# EAGLE design nsq-10 (EAGLE 6.2)
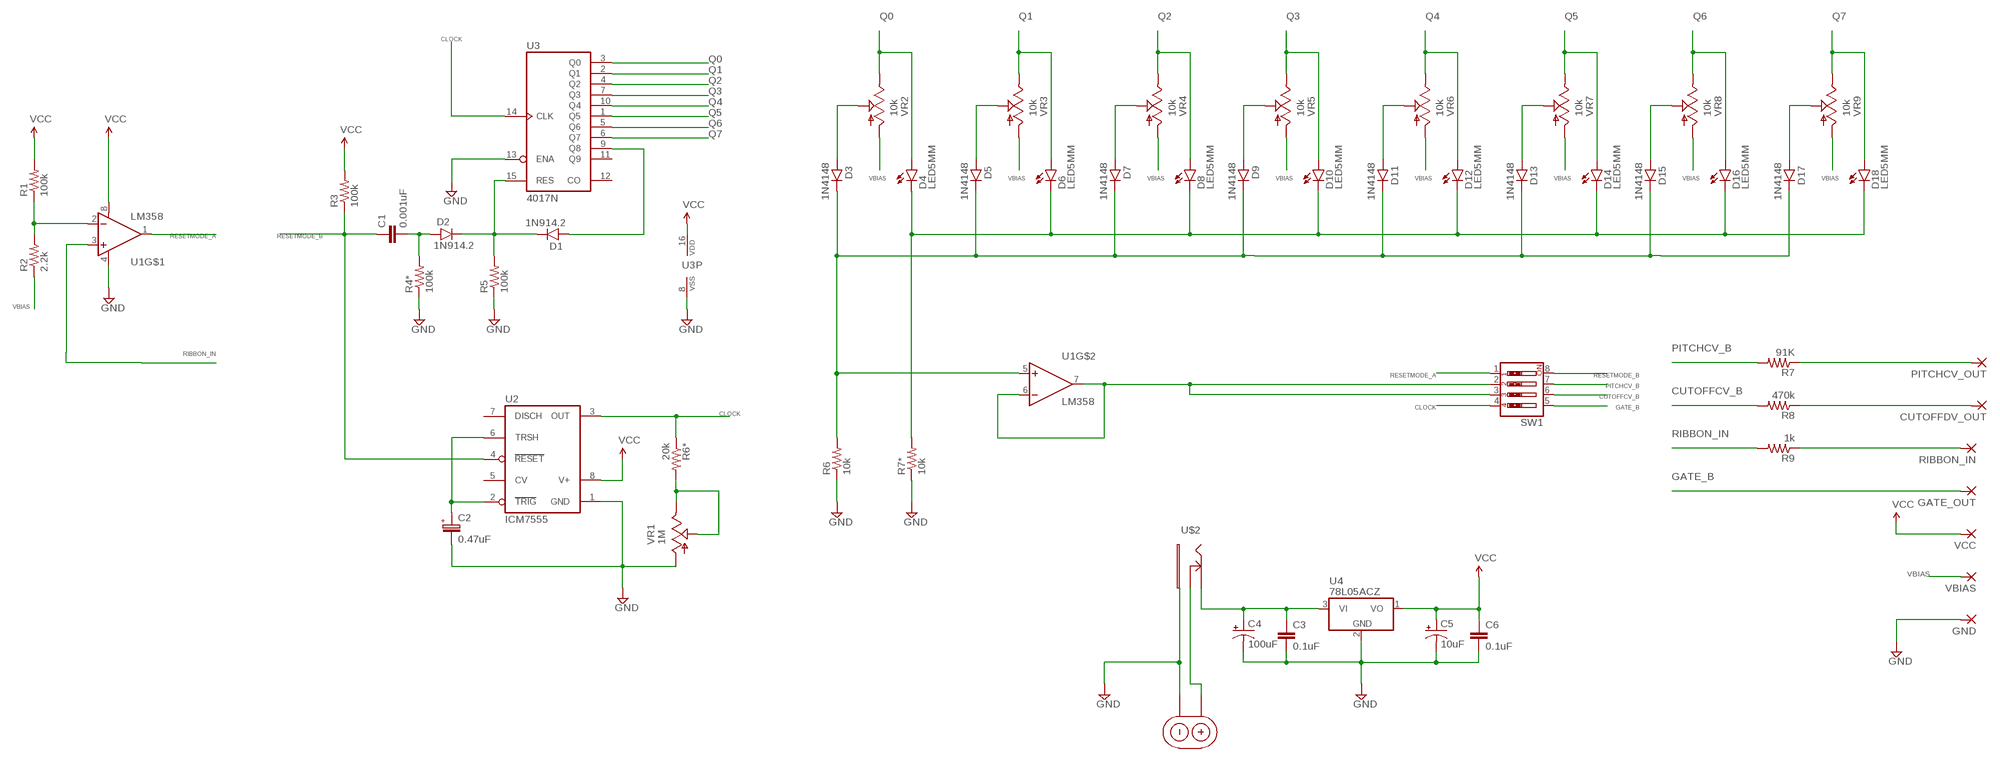
[diagram p0: schematic, sheet 1]

## Parts
C1  0.001uF  CERAMIC_CAPACITOR  [CERAMIC_CAP]
C2  0.47uF  063-EU  [063_025]
C3  0.1uF  CERAMIC_CAPACITOR  [CERAMIC_CAP]
C4  100uF  0631  [063_025]
C5  10uF  0631  [063_025]
C6  0.1uF  CERAMIC_CAPACITOR  [CERAMIC_CAP]
CUTOFFDV_OUT  1,6/0,8  [1,6/0,8]
D1  1N914.2  [DO35-2]
D2  1N914.2  [DO35-2]
D3  1N4148  1N914.2  [DO35-2]
D4  LED5MM  [LED5MM]
D5  1N4148  1N914.2  [DO35-2]
D6  LED5MM  [LED5MM]
D7  1N4148  1N914.2  [DO35-2]
D8  LED5MM  [LED5MM]
D9  1N4148  1N914.2  [DO35-2]
D10  LED5MM  [LED5MM]
D11  1N4148  1N914.2  [DO35-2]
D12  LED5MM  [LED5MM]
D13  1N4148  1N914.2  [DO35-2]
D14  LED5MM  [LED5MM]
D15  1N4148  1N914.2  [DO35-2]
D16  LED5MM  [LED5MM]
D17  1N4148  1N914.2  [DO35-2]
D18  LED5MM  [LED5MM]
GATE_OUT  1,6/0,8  [1,6/0,8]
GND  1,6/0,8  [1,6/0,8]
PITCHCV_OUT  1,6/0,8  [1,6/0,8]
R1  100k  RESISTOR  [RESISTOR]
R2  2.2k  RESISTOR  [RESISTOR]
R3  100k  RESISTOR  [RESISTOR]
R4*  100k  RESISTOR  [RESISTOR]
R5  100k  RESISTOR  [RESISTOR]
R6  10k  RESISTOR  [RESISTOR]
R6*  20k  RESISTOR  [RESISTOR]
R7  91K  RESISTOR  [RESISTOR]
R7*  10k  RESISTOR  [RESISTOR]
R8  470k  RESISTOR  [RESISTOR]
R9  1k  RESISTOR  [RESISTOR]
RIBBON_IN  1,6/0,8  [1,6/0,8]
SW1  SW_DIP-4  [EDG-04]
U1  LM358  [DIP08]
U2  ICM7555  [DIL08]
U3  4017N  [DIL16]
U4  78L05ACZ  [TO-92]
U$1  9V_BATTERY_CLIP  [9V_BATTERY]
U$2  DC_JACK_OFFBOARD  [DC_JACK_OFFBOARD]
VBIAS  1,6/0,8  [1,6/0,8]
VCC  1,6/0,8  [1,6/0,8]
VR1  1M  TRIM_US-B25P  [B25P]
VR2  10k  TRIM_US-B25P  [B25P]
VR3  10k  TRIM_US-B25P  [B25P]
VR4  10k  TRIM_US-B25P  [B25P]
VR5  10k  TRIM_US-B25P  [B25P]
VR6  10k  TRIM_US-B25P  [B25P]
VR7  10k  TRIM_US-B25P  [B25P]
VR8  10k  TRIM_US-B25P  [B25P]
VR9  10k  TRIM_US-B25P  [B25P]

## Nets
CLOCK: R6*.1 SW1.4 U2.3(OUT) U3.14(CLK)
CUTOFFCV_B: R8.2 SW1.6
GATE_B: GATE_OUT.1(P) SW1.5
GND: C2.- C3.2 C4.- C5.- C6.2 GND.1(P) R4*.1 R5.1 R6.1 R7*.1 U1.4(V-) U2.1(GND) U3.8(VSS) U3.13(ENA) U4.2(GND) U$1.9V_BATTERY_- U$2.PIN VR1.A
N$1: C1.2 D2.A R4*.2
N$2: R1.1 R2.2 U1.2(-IN)
N$3: R6*.2 VR1.E VR1.S
N$4: C2.+ U2.2(TRIG) U2.6(TRSH)
N$5: SW1.2 SW1.3 U1.6(-IN) U1.7(OUT)
N$6: D3.A VR2.S
N$7: R9.1 RIBBON_IN.1(P)
N$8: D5.A VR3.S
N$9: D1.A U3.9(Q8)
N$10: D1.C D2.C R5.2 U3.15(RES)
N$11: CUTOFFDV_OUT.1(P) R8.1
N$12: D7.A VR4.S
N$13: PITCHCV_OUT.1(P) R7.1
N$14: D9.A VR5.S
N$16: D11.A VR6.S
N$18: D13.A VR7.S
N$19: U$1.9V_BATTERY_+ U$2.CONNECT
N$20: D15.A VR8.S
N$21: C3.1 C4.+ U4.3(VI) U$2.SLEEVE
N$22: D17.A VR9.S
N$23: D4.K(C) D6.K(C) D8.K(C) D10.K(C) D12.K(C) D14.K(C) D16.K(C) D18.K(C) R7*.2
N$26: D3.C D5.C D7.C D9.C D11.C D13.C D15.C D17.C R6.2 U1.5(+IN)
PITCHCV_B: R7.2 SW1.7
Q0: D4.A U3.3(Q0) VR2.E
Q1: D6.A U3.2(Q1) VR3.E
Q2: D8.A U3.4(Q2) VR4.E
Q3: D10.A U3.7(Q3) VR5.E
Q4: D12.A U3.10(Q4) VR6.E
Q5: D14.A U3.1(Q5) VR7.E
Q6: D16.A U3.5(Q6) VR8.E
Q7: D18.A U3.6(Q7) VR9.E
RESETMODE_A: SW1.1 U1.1(OUT)
RESETMODE_B: C1.1 R3.1 SW1.8 U2.4(RESET)
RIBBON_IN: R9.2 U1.3(+IN)
VBIAS: R2.1 VBIAS.1(P) VR2.A VR3.A VR4.A VR5.A VR6.A VR7.A VR8.A VR9.A
VCC: C5.+ C6.1 R1.2 R3.2 U1.8(V+) U2.8(V+) U3.16(VDD) U4.1(VO) VCC.1(P)
Unconnected: U2.5(CV) U2.7(DISCH) U3.11(Q9) U3.12(CO)

## Library data of the parts
C1 C3 C6 = 00_steve:CERAMIC_CAPACITOR
C2 = gm-caps-electro-pol:063-EU
C4 C5 = gm-caps-electro-pol:063: 33 - 220uF Xicon values at Mouser.com 10V: 220uF; 16V: 100uF; 25V: 100uF; 50V: 33uF
CUTOFFDV_OUT GATE_OUT GND PITCHCV_OUT RIBBON_IN VBIAS VCC = wirepad:1,6/0,8: THROUGH-HOLE PAD
D1-D3 D5 D7 D9 D11 D13 D15 D17 = gm-diodes:1N914: Fast Switching Diode DO-35 glass case a.k.a. 1N4148
D4 D6 D8 D10 D12 D14 D16 D18 = gm-diodes:LED
R1-R3 R4* R5 R6 R6* R7 R7* R8 R9 = 00_steve:RESISTOR
SW1 = special:SW_DIP-4: DIP SWITCH
U1 = SparkFun:LM358
U2 = maxim:ICM7555: TIMER; MF: MAXIM; MPN: ICM7555IPA+; OC_FARNELL: 9663762; OC_NEWARK: 68K4387
U3 = 40xx:4017: COUNTER/DIVIDER
U4 = 00_steve:78L05ACZ
U$1 = 00_steve:9V_BATTERY_CLIP
U$2 = 00_steve:DC_JACK_OFFBOARD
VR1-VR9 = pot:TRIM_US-: POTENTIOMETER

## Board
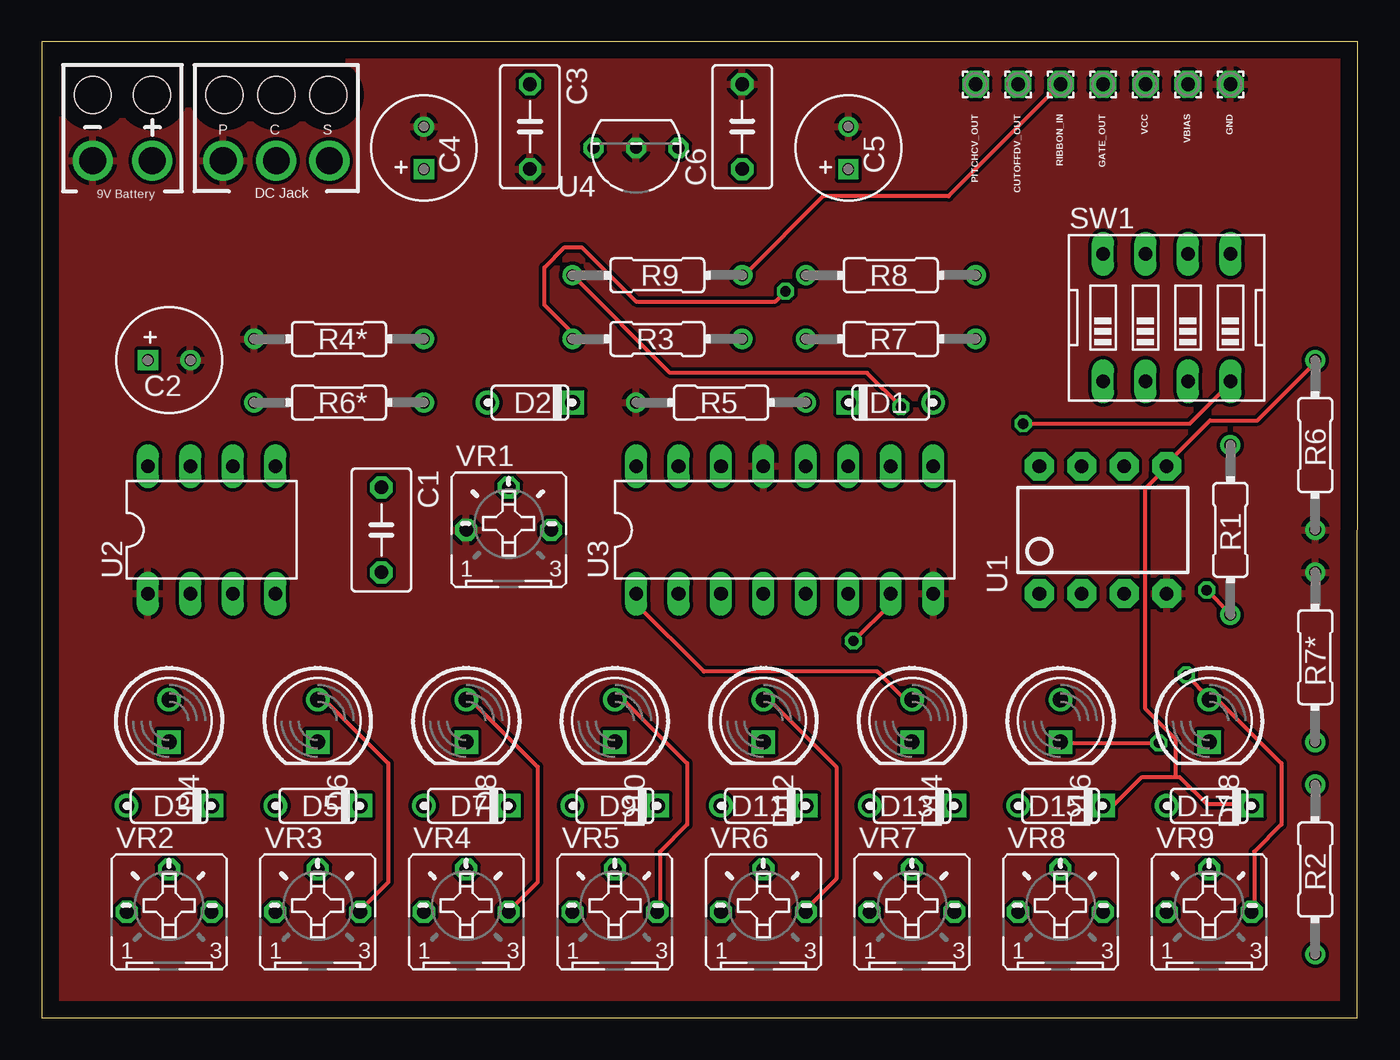
[diagram p1: board, top side]
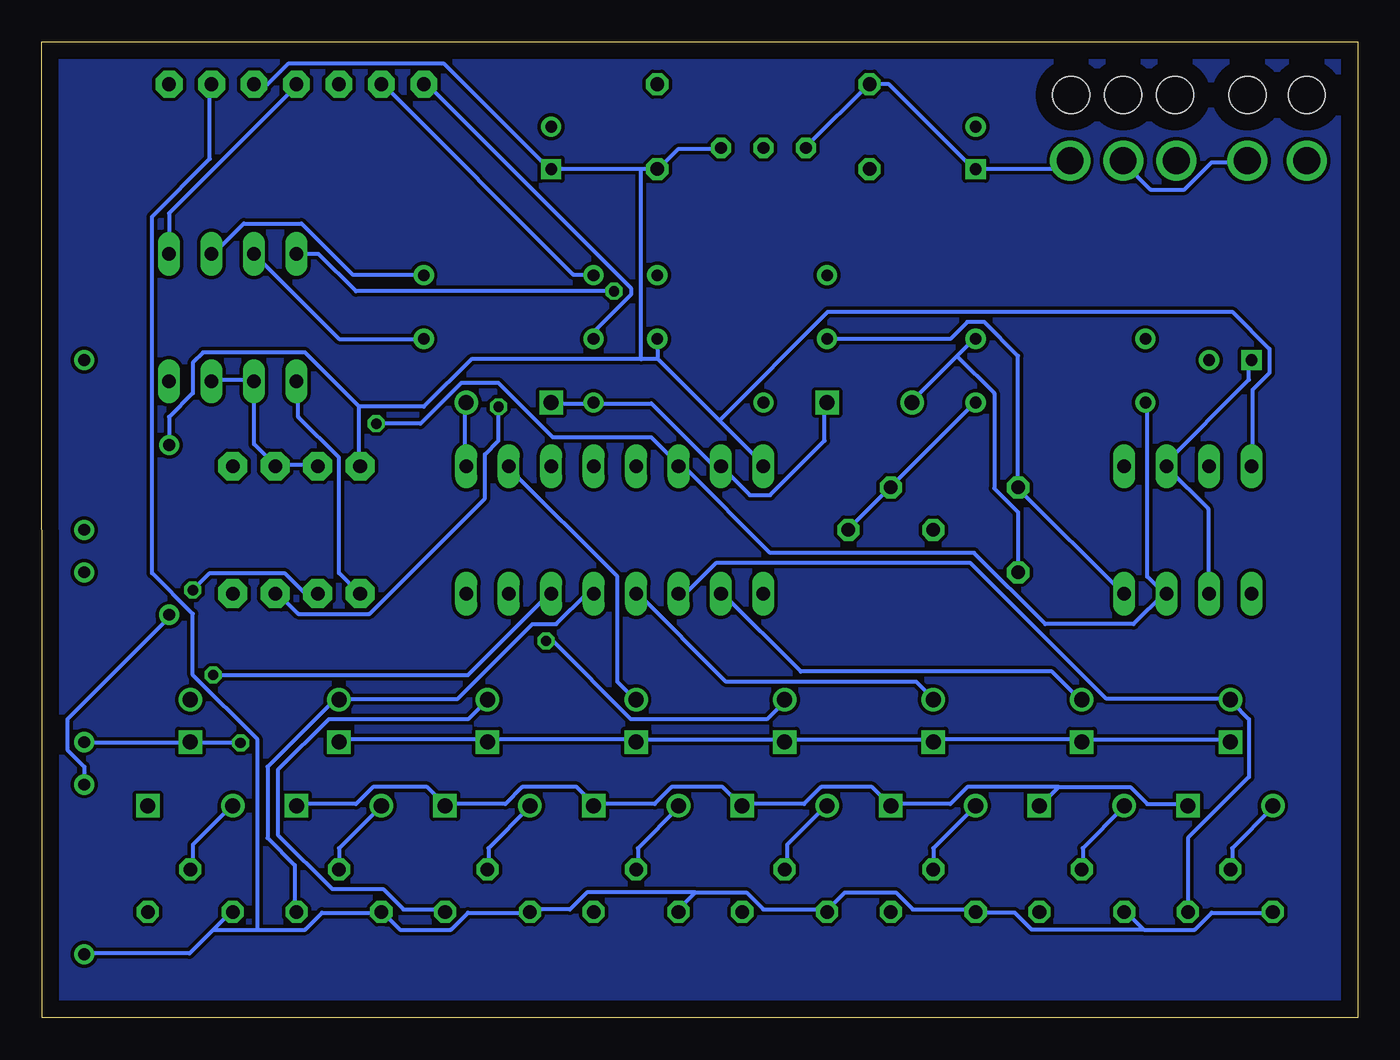
[diagram p2: board, bottom side, seen from below]

Size 78.74 x 58.42 mm. Coordinates in mm from the lower left corner, seen from the top.
Outline: 0,0 78.72,0 78.74,58.42 0,58.42 0,0
Copper layers (1*16): Top 0.035mm / dielectric 1.5mm / Bottom 0.035mm
Design rules: minimum track width 10mil, minimum drill 24mil, track to track 8mil, track to pad 8mil, pad to pad 8mil, via to via 8mil, smd to smd 8mil, copper to edge 40mil, drill to drill 8mil, minimum pad ring 10mil, minimum via ring 8mil, stop-mask expansion 4mil, vias tented up to drill 0mil, thermal gap 10mil

### Footprints (pad centres in the part's own frame; a part is rotated, then mirrored left to right if it is on the bottom)
CERAMIC_CAP = drill 0.813 octagon: 1 -2.54,0; 2 2.54,0
063_025 = drill 0.7 square: + -1.27,0 | drill 0.7: - 1.27,0
1,6/0,8 = drill 0.813 pad 1.6 octagon: 1 0,0
DO35-2 = drill 0.9: A 2.54,0 | drill 0.9 square: C -2.54,0
LED5MM = drill 0.9: A -1.27,0 | drill 0.9 square: K 1.27,0
RESISTOR = drill 0.7: 1 -5.08,0; 2 5.08,0
EDG-04 = drill 0.813 long: 1 -3.81,-3.81; 2 -1.27,-3.81; 3 1.27,-3.81; 4 3.81,-3.81; 5 3.81,3.81; 6 1.27,3.81; 7 -1.27,3.81; 8 -3.81,3.81
DIP08 = drill 0.813 pad 1.727 octagon: 1 -3.81,-3.81; 2 -1.27,-3.81; 3 1.27,-3.81; 4 3.81,-3.81; 5 3.81,3.81; 6 1.27,3.81; 7 -1.27,3.81; 8 -3.81,3.81
DIL08 = drill 0.813 long: 1 -3.81,-3.81; 2 -1.27,-3.81; 3 1.27,-3.81; 4 3.81,-3.81; 5 3.81,3.81; 6 1.27,3.81; 7 -1.27,3.81; 8 -3.81,3.81
DIL16 = drill 0.813 long: 1 -8.89,-3.81; 2 -6.35,-3.81; 3 -3.81,-3.81; 4 -1.27,-3.81; 5 1.27,-3.81; 6 3.81,-3.81; 7 6.35,-3.81; 8 8.89,-3.81; 9 8.89,3.81; 10 6.35,3.81; 11 3.81,3.81; 12 1.27,3.81; 13 -1.27,3.81; 14 -3.81,3.81; 15 -6.35,3.81; 16 -8.89,3.81
TO-92 = drill 0.7 octagon: 1 -2.54,0; 2 0,0; 3 2.54,0
9V_BATTERY = drill 1.6: 9V_BATTERY_+ -1.778,1.27; 9V_BATTERY_- 1.778,1.27 | hole 2.2: -1.778,-2.667; 1.778,-2.667
DC_JACK_OFFBOARD = drill 1.6: CONNECT 0,1.27; PIN 3.175,1.27; SLEEVE -3.175,1.27 | hole 2.2: -3.111,-2.667; 0,-2.667; 3.111,-2.667
B25P = drill 0.813 octagon: A -2.54,0; E 2.54,0; S 0,2.54

### Placement (x,y rotation side)
C1  20.32,29.21 270 top
C2  7.62,39.37 0 top
C3  29.21,53.34 270 top
C4  22.86,52.07 90 top
C5  48.26,52.07 90 top
C6  41.91,53.34 90 top
CUTOFFDV_OUT  58.42,55.88 270 top
D1  50.8,36.83 0 top
D2  29.21,36.83 180 top
D3  7.62,12.7 180 top
D4  7.62,17.78 270 top
D5  16.51,12.7 180 top
D6  16.51,17.78 270 top
D7  25.4,12.7 180 top
D8  25.4,17.78 270 top
D9  34.29,12.7 180 top
D10  34.29,17.78 270 top
D11  43.18,12.7 180 top
D12  43.18,17.78 270 top
D13  52.07,12.7 180 top
D14  52.07,17.78 270 top
D15  60.96,12.7 180 top
D16  60.96,17.78 270 top
D17  69.85,12.7 180 top
D18  69.85,17.78 270 top
GATE_OUT  63.5,55.88 270 top
GND  71.12,55.88 0 top
PITCHCV_OUT  55.88,55.88 270 top
R1  71.12,29.21 90 top
R2  76.2,8.89 90 top
R3  36.83,40.64 0 top
R4*  17.78,40.64 0 top
R5  40.64,36.83 0 top
R6  76.2,34.29 90 top
R6*  17.78,36.83 0 top
R7  50.8,40.64 0 top
R7*  76.2,21.59 270 top
R8  50.8,44.45 0 top
R9  36.83,44.45 180 top
RIBBON_IN  60.96,55.88 270 top
SW1  67.31,41.91 0 top
U1  63.5,29.21 0 top
U2  10.16,29.21 0 top
U3  44.45,29.21 0 top
U4  35.56,52.07 180 top
U$1  4.83,52.58 180 top
U$2  14.03,52.58 180 top
VBIAS  68.58,55.88 270 top
VCC  66.04,55.88 270 top
VR1  27.94,29.21 0 top
VR2  7.62,6.35 0 top
VR3  16.51,6.35 0 top
VR4  25.4,6.35 0 top
VR5  34.29,6.35 0 top
VR6  43.18,6.35 0 top
VR7  52.07,6.35 0 top
VR8  60.96,6.35 0 top
VR9  69.85,6.35 0 top

### Tracks (layer width: path | path; a pad name or v marks a point on that pad's centre or on a via)
CLOCK  (via drill 0.61)
  Top 0.254: v58.73,35.56 68.68,35.56 71.12,38 SW1.4
  Bottom 0.254: 11.58,25.4 12.6,26.42 12.6,36.78 R6*.1 | 11.58,25.4 13.41,23.57 18.69,23.57 22.96,27.84 35.15,27.84 40.23,32.92 40.64,32.92 U3.14 40.64,33.12 42.27,34.75 48.16,34.75 51.41,38 53.65,38 56.08,35.56 v58.73,35.56 | 11.58,25.4 U2.3
CUTOFFCV_B
  Bottom 0.254: R8.2 55.88,44.5 60.15,44.5 63.2,47.55 66.65,47.55 68.48,45.72 SW1.6
GATE_B
  Bottom 0.254: SW1.5 71.12,48.16 63.4,55.88 GATE_OUT.1
GND
  pour Top: 0,58.42 78.74,58.42 78.74,0 0,0
N$1
  Bottom 0.254: 23.98,39.62 26.62,36.98 D2.A | 23.98,39.62 22.96,40.64 R4*.2 | C1.2 20.32,30.28 21.74,31.7 21.74,37.39 23.98,39.62
N$2  (via drill 0.61)
  Top 0.254: v69.7,25.6 71.12,24.18 R1.1
  Bottom 0.254: R2.2 76.2,15.04 77.22,16.05 77.22,17.88 71.12,23.98 R1.1 | U1.2 62.99,25.4 64.21,26.62 68.68,26.62 v69.7,25.6
N$3
  Bottom 0.254: R6*.2 22.96,36.78 27.84,31.9 VR1.S 28.04,31.7 30.48,29.26 VR1.E
N$4
  Bottom 0.254: C2.+ 6.5,39.22 6.5,38.2 11.58,33.12 U2.6 11.38,32.92 8.94,30.48 8.94,25.4 U2.2
N$5
  Bottom 0.254: SW1.3 68.48,38.2 66.04,38.2 SW1.2 66.04,34.34 64.82,33.12 U1.6 64.62,33.12 62.38,33.12 U1.7
N$6
  Bottom 0.254: VR2.S 7.52,8.94 7.52,10.16 5.08,12.6 D3.A
N$7
  Top 0.254: RIBBON_IN.1 54.25,49.17 46.74,49.17 42.06,44.5 R9.1
N$8
  Bottom 0.254: VR3.S 16.46,8.94 16.46,10.16 14.02,12.6 D5.A
N$9
  Bottom 0.254: U3.9 53.44,33.12 53.44,36.78 D1.A
N$10
  Bottom 0.254: 45.72,36.78 48.16,36.78 D1.C | 45.72,36.78 42.27,36.78 38.61,33.12 38.2,33.12 U3.15 36.37,31.29 35.15,31.29 31.9,34.54 31.9,36.78 D2.C | 45.72,36.78 R5.2
N$11
  Bottom 0.254: R8.1 45.72,44.5 46.94,44.5 58.32,55.88 CUTOFFDV_OUT.1
N$12
  Bottom 0.254: VR4.S 25.4,10.16 D7.A
N$13
  Bottom 0.254: R7.1 45.72,41.05 43.48,43.28 43.48,43.69 55.68,55.88 PITCHCV_OUT.1
N$14
  Bottom 0.254: VR5.S 34.14,8.94 34.14,10.36 31.9,12.6 D9.A
N$15
  pour Bottom: 0,58.42 78.74,58.42 78.74,0 0,0
N$16
  Bottom 0.254: VR6.S 43.08,8.94 43.08,10.16 40.64,12.6 D11.A
N$18
  Bottom 0.254: VR7.S 52.02,8.94 52.02,10.16 49.58,12.6 D13.A
N$19
  Bottom 0.254: U$1.9V_BATTERY_+ 6.71,51.21 8.74,51.21 10.36,49.58 12.39,49.58 14.02,51.21 U$2.CONNECT
N$20
  Bottom 0.254: VR8.S 60.96,10.16 D15.A
N$21
  Bottom 0.254: U4.3 32.92,52.22 29.26,55.88 C3.1 28.04,55.88 22.96,50.8 C4.+ 17.68,50.8 17.27,51.21 U$2.SLEEVE
N$22
  Bottom 0.254: VR9.S 69.7,8.94 69.7,10.36 67.46,12.6 D17.A
N$23  (via drill 0.61)
  Top 0.254: v66.85,16.46 60.96,16.46 D16.K
  Bottom 0.254: D4.K 7.72,16.66 16.46,16.66 D6.K 16.66,16.66 25.4,16.66 | R7*.2 76.2,16.46 69.9,16.46 D18.K 69.7,16.46 v66.85,16.46 | D16.K 60.96,16.66 52.22,16.66 D14.K 52.02,16.66 43.28,16.66 D12.K 43.08,16.66 34.34,16.66 D10.K 34.14,16.66 25.4,16.66 | 25.4,16.66 D8.K
N$26
  Top 0.254: R6.2 76.2,39.22 72.75,35.76 69.9,35.76 67.26,33.12 U1.5 67.26,32.92 66.04,31.7 66.04,18.49 67.87,16.66 67.87,14.43 | 67.87,14.43 65.84,14.43 64.01,12.6 63.6,12.6 D15.C | 67.87,14.43 68.07,14.43 69.7,12.8 72.34,12.8 D17.C
  Bottom 0.254: 17.88,13.82 13.61,13.82 12.6,12.8 10.16,12.8 D3.C | 17.88,13.82 18.9,12.8 D5.C | 17.88,13.82 23.37,13.82 24.38,12.8 27.84,12.8 D7.C 29.06,13.82 32.11,13.82 33.12,12.8 36.78,12.8 D9.C 36.98,12.8 38,13.82 41.05,13.82 42.06,12.8 45.72,12.8 | 45.72,12.8 46.74,13.82 49.99,13.82 51,12.8 54.46,12.8 D13.C 54.66,12.8 55.68,13.82 58.93,13.82 59.94,12.8 63.4,12.8 D15.C | 45.72,12.8 D11.C
PITCHCV_B
  Bottom 0.254: R7.2 60.96,40.64 SW1.7
Q0
  Bottom 0.254: VR2.E 10.16,10.77 6.5,14.43 6.5,17.88 7.52,18.9 D4.A 7.72,19.1 15.04,19.1 23.16,27.23 38.41,27.23 40.23,25.4 U3.3
Q1
  Top 0.254: VR3.E 19.1,6.5 20.73,8.13 20.73,15.24 17.07,18.9 16.66,18.9 D6.A
  Bottom 0.254: U3.2 38,25.4 33.33,20.73 18.29,20.73 16.66,19.1 D6.A
Q2
  Top 0.254: VR4.E 28.04,6.5 29.67,8.13 29.67,15.04 25.81,18.9 25.4,18.9 D8.A
  Bottom 0.254: U3.4 43.08,25.4 37.8,20.12 26.42,20.12 25.4,19.1 D8.A
Q3  (via drill 0.61)
  Top 0.254: VR5.E 36.98,6.5 36.98,9.96 38.61,11.58 38.61,15.24 34.95,18.9 34.34,18.9 D10.A | U3.7 50.8,24.79 v48.56,22.55
  Bottom 0.254: v48.56,22.55 48.16,22.55 43.48,17.88 35.36,17.88 34.34,18.9 D10.A
Q4
  Top 0.254: VR6.E 45.72,6.5 47.55,8.33 47.55,15.04 43.69,18.9 43.28,18.9 D12.A
  Bottom 0.254: U3.10 50.8,32.92 44.3,26.42 44.3,20.12 43.28,19.1 D12.A
Q5
  Top 0.254: U3.1 35.56,24.79 39.62,20.73 49.99,20.73 51.61,19.1 52.02,19.1 D14.A
  Bottom 0.254: D14.A 53.24,17.88 61.57,17.88 64.62,14.83 64.62,10.97 61.37,7.72 58.32,7.72 57.1,6.5 54.66,6.5 VR7.E
Q6
  Bottom 0.254: VR8.E 63.6,6.5 63.6,9.14 65.23,10.77 65.23,15.04 61.37,18.9 60.96,18.9 D16.A 60.96,19.1 53.85,19.1 49.38,23.57 47.95,23.57 46.13,25.4 U3.5
Q7  (via drill 0.61)
  Top 0.254: v68.48,20.52 69.9,19.1 D18.A 69.9,18.9 70.51,18.9 74.17,15.24 74.17,11.58 72.54,9.96 72.54,6.5 VR9.E
  Bottom 0.254: v68.48,20.52 53.24,20.52 48.36,25.4 U3.6
RESETMODE_A
  Bottom 0.254: SW1.1 63.4,38 63.4,35.97 60.96,33.53 60.96,26.62 59.74,25.4 U1.1
RESETMODE_B  (via drill 0.61)
  Top 0.254: v44.5,43.48 43.89,42.88 35.56,42.88 32.31,46.13 31.29,46.13 30.07,44.91 30.07,42.67 31.7,41.05 31.7,40.64 R3.1
  Bottom 0.254: R3.1 24.38,40.64 23.37,41.66 22.35,41.66 20.32,39.62 C1.1 20.32,31.7 14.02,25.4 U2.4 | SW1.8 62.18,45.72 59.94,43.48 v44.5,43.48
RIBBON_IN  (via drill 0.61)
  Top 0.254: R9.2 37.59,38.61 49.38,38.61 v51.41,36.58
  Bottom 0.254: v51.41,36.58 51.41,34.54 52.22,33.73 52.22,31.09 59.13,24.18 63.4,24.18 64.62,25.4 U1.3
VBIAS
  Bottom 0.254: 12.8,5.28 9.75,5.28 8.74,6.3 5.08,6.3 VR2.A | 12.8,5.28 13.82,6.3 VR3.A | 12.8,5.28 19.51,5.28 20.52,6.3 22.76,6.3 VR4.A 22.96,6.5 26.62,6.5 27.64,7.52 30.68,7.52 31.7,6.5 VR5.A 31.9,6.5 35.56,6.5 36.58,7.52 39.62,7.52 | 39.62,7.52 40.64,6.5 VR6.A | 39.62,7.52 46.13,7.52 47.14,6.5 49.38,6.5 VR7.A 49.58,6.3 53.24,6.3 54.25,5.28 57.3,5.28 58.32,6.3 VR8.A 58.52,6.3 61.98,6.3 62.99,5.28 65.84,5.28 | 68.48,5.28 67.46,6.3 VR9.A | 68.48,5.28 69.9,3.86 76.2,3.86 R2.1 | 68.48,5.28 65.84,5.28 | 65.84,5.28 65.84,16.66 69.7,20.52 69.7,24.18 72.14,26.62 72.14,47.95 68.68,51.41 68.68,55.88 VBIAS.1
VCC
  Bottom 0.254: U4.1 38.2,52.02 40.64,52.02 41.86,50.8 C6.1 42.88,50.8 | 42.88,50.8 C5.+ 48.36,50.8 54.66,57.1 64.01,57.1 65.23,55.88 VCC.1 | R1.2 71.12,35.97 69.7,37.39 69.7,39.22 69.09,39.83 62.99,39.83 59.74,36.58 | 59.74,36.58 59.74,33.12 U1.8 | 41.86,39.42 41.86,40.64 R3.2 | 38.2,35.76 35.56,33.12 U3.16 | 38.2,35.76 41.86,39.42 | 38.2,35.76 31.7,42.27 7.52,42.27 5.28,40.03 5.28,38.61 6.3,37.59 6.3,33.12 U2.8 | 59.74,36.58 55.88,36.58 53.03,39.42 42.88,39.42 | 41.86,39.42 42.88,39.42 | 42.88,39.42 42.88,50.8